# Altium schematic sheet BMS Communications.SchDoc
size A
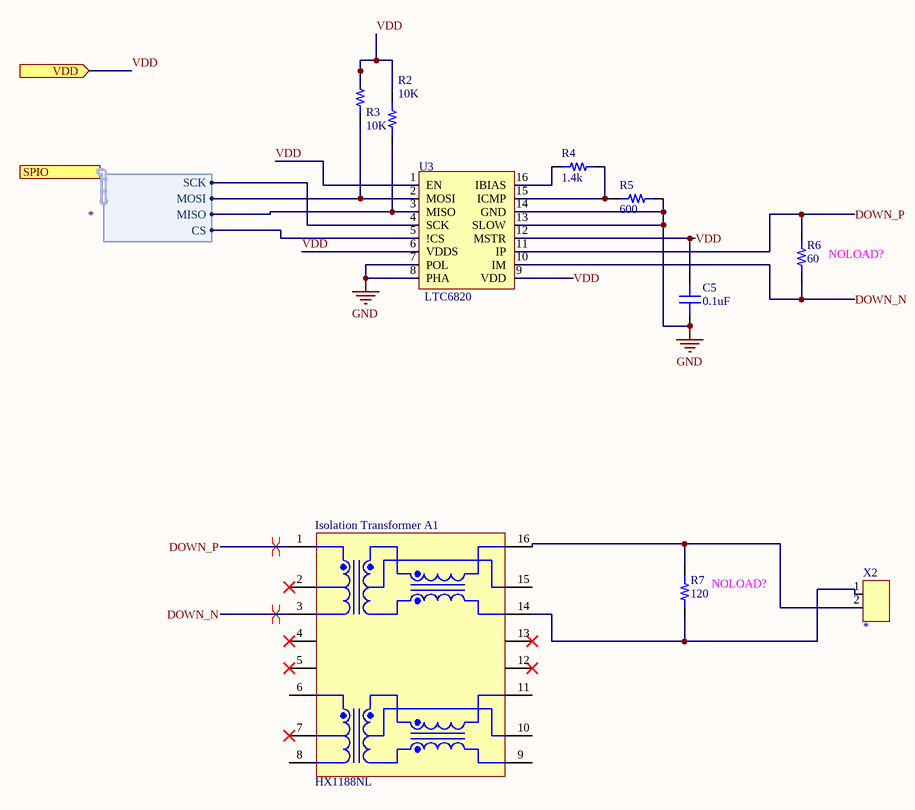
[diagram p0: BMS Communications.SchDoc]

## Parts
C5  capacitance: 0.1uF  [0603]  (hidden comment: capacitor)
Isolation_Transformer_A1  HX1188NL  [PULS-MODULE-16_V]
R2  10K  [RES 0603/1608]
R3  10K  [RES 0603/1608]
R4  1.4k  [RES 0603/1608]
R5  600  [RES 0603/1608]
R6  60  [RES 0603/1608]
R7  120  [RES 0603/1608]
U3  LTC6820  [MSOP-16]
X2  *  [CONN 43650-0200 MOLEX 2PIN]

## Ports
SPIO (harness *), VDD (in)

## Harnesses
*: SCK, MOSI, MISO, CS

## Nets
GND: C5.1 R5.1 U3.7(POL) U3.8(PHA) U3.13(SLOW) U3.14(GND)
DOWN_N: Isolation_Transformer_A1.3 R6.1 U3.10(IM)
DOWN_P: Isolation_Transformer_A1.1 R6.2 U3.11(IP)
VDD: C5.2 R2.2 R3.1 U3.1(EN) U3.6(VDDS) U3.9(VDD) U3.12(MSTR) ; port VDD
NetIsolation_Transformer_A1_14: Isolation_Transformer_A1.14 R7.1 X2.1
NetIsolation_Transformer_A1_16: Isolation_Transformer_A1.16 R7.2 X2.2
NetR2_1: R2.1 U3.3(MISO) ; port SPIO.MISO
NetR3_2: R3.2 U3.2(MOSI) ; port SPIO.MOSI
NetR4_1: R4.1 R5.2 U3.15(ICMP)
NetR4_2: R4.2 U3.16(IBIAS)
NetU3_4: U3.4(SCK) ; port SPIO.SCK
NetU3_5: U3.5(!CS) ; port SPIO.CS

Not connected (* = marked no-connect by the designer): Isolation_Transformer_A1 2* 4* 5* 6 7* 8 9 10 11 12* 13* 15

## Layout directives
differential pair: DOWN_N, DOWN_P

## Notes on the sheet
- (near R6) NOLOAD?
- (near R7) NOLOAD?

## Library data of the parts
C5 = 1: Generic 0603 capacitor; id: 1; voltage: 50; dielectric: Ceramic; percent tolerance: 10; name: 0603 Capacitor; ESR: 1; package: 0603; quantity: 0
Isolation_Transformer_A1 = CMP-2000-05323-1: 10/100 Base-T Single Port Surface Mount Magnetic with Turns Ratio, -40 to 85 degC, 16-Pin Module, RoHS, Tube; Manufacturer: Pulse Electronics; Other Related Documents: PackagesFNLvs.NL; Other Names: 553-1340; PCN Design/Specification: ThermoplasticHeaderDesign28/Jun/2013; Transformer Type: IsolationandDataInterface(Encapsulated); PCN Other: HaloInjunctionRes1/Sep/2015; Turns Ratio - Primary: Secondary:1:1Transmitter,1:1Receiver; Family: PulseTransformers; Datasheet URL: https://datasheet.ciiva.com/26929/hx1188nl-26929858.pdf; Mounting Type: SurfaceMount; Size / Dimension: 12.70mmLx7.11mmW; Inductance: -; Package Description: 16-Pin Surface Mount Device, Body 12.7 x 7.11 mm, Pitch 1.27 mm; Height - Seated (Max): 6.22mm; E.T.: -; Online Catalog: 10/100BASE-TSinglePort; Manufacturer URL: http://www.pulseelectronics.com/; Package Reference: MODULE-16; Series: -; Category: Transformers; Standard Package: 40; Datasheet Version: Rev. H325.Q, 09/2009
R2-R7 = 1: id: 1; name: 0603 Resistor; percent tolerance: 5; package: 0603; quantity: 0
  R2 R3: resistance: 10K
  R4: resistance: 1.4k
  R5: resistance: 600
  R6: resistance: 60
  R7: resistance: 120
U3 = 7: soSPI Isolated / Communications Interface; Manufacturer_id: 1; idFuse: 3; Name: null; id: 7; vcc: 0; Drawer_id: 1; type: isoSPI; package: MSOP-16; quantity: 0; link: https://www.mouser.com/ProductDetail/Analog-Devices/LTC6820IMSPBF?qs=sGAEpiMZZMvi6wO7nhr1LyTLeBC7dAWQpR44bZH0zYY%3d
X2 = 9: Molex 43650_0200; id: 9; name: 0436500200; numcontacts: 2; numrows: 1; pitch: 3 mm; MfrPartNo: *; quantity: 0; link: https://www.digikey.com/product-detail/en/molex-llc/0436500200/WM1860-ND/268989